# EasyEDA Pro project firefly_rp2040.eprj, board PCB2
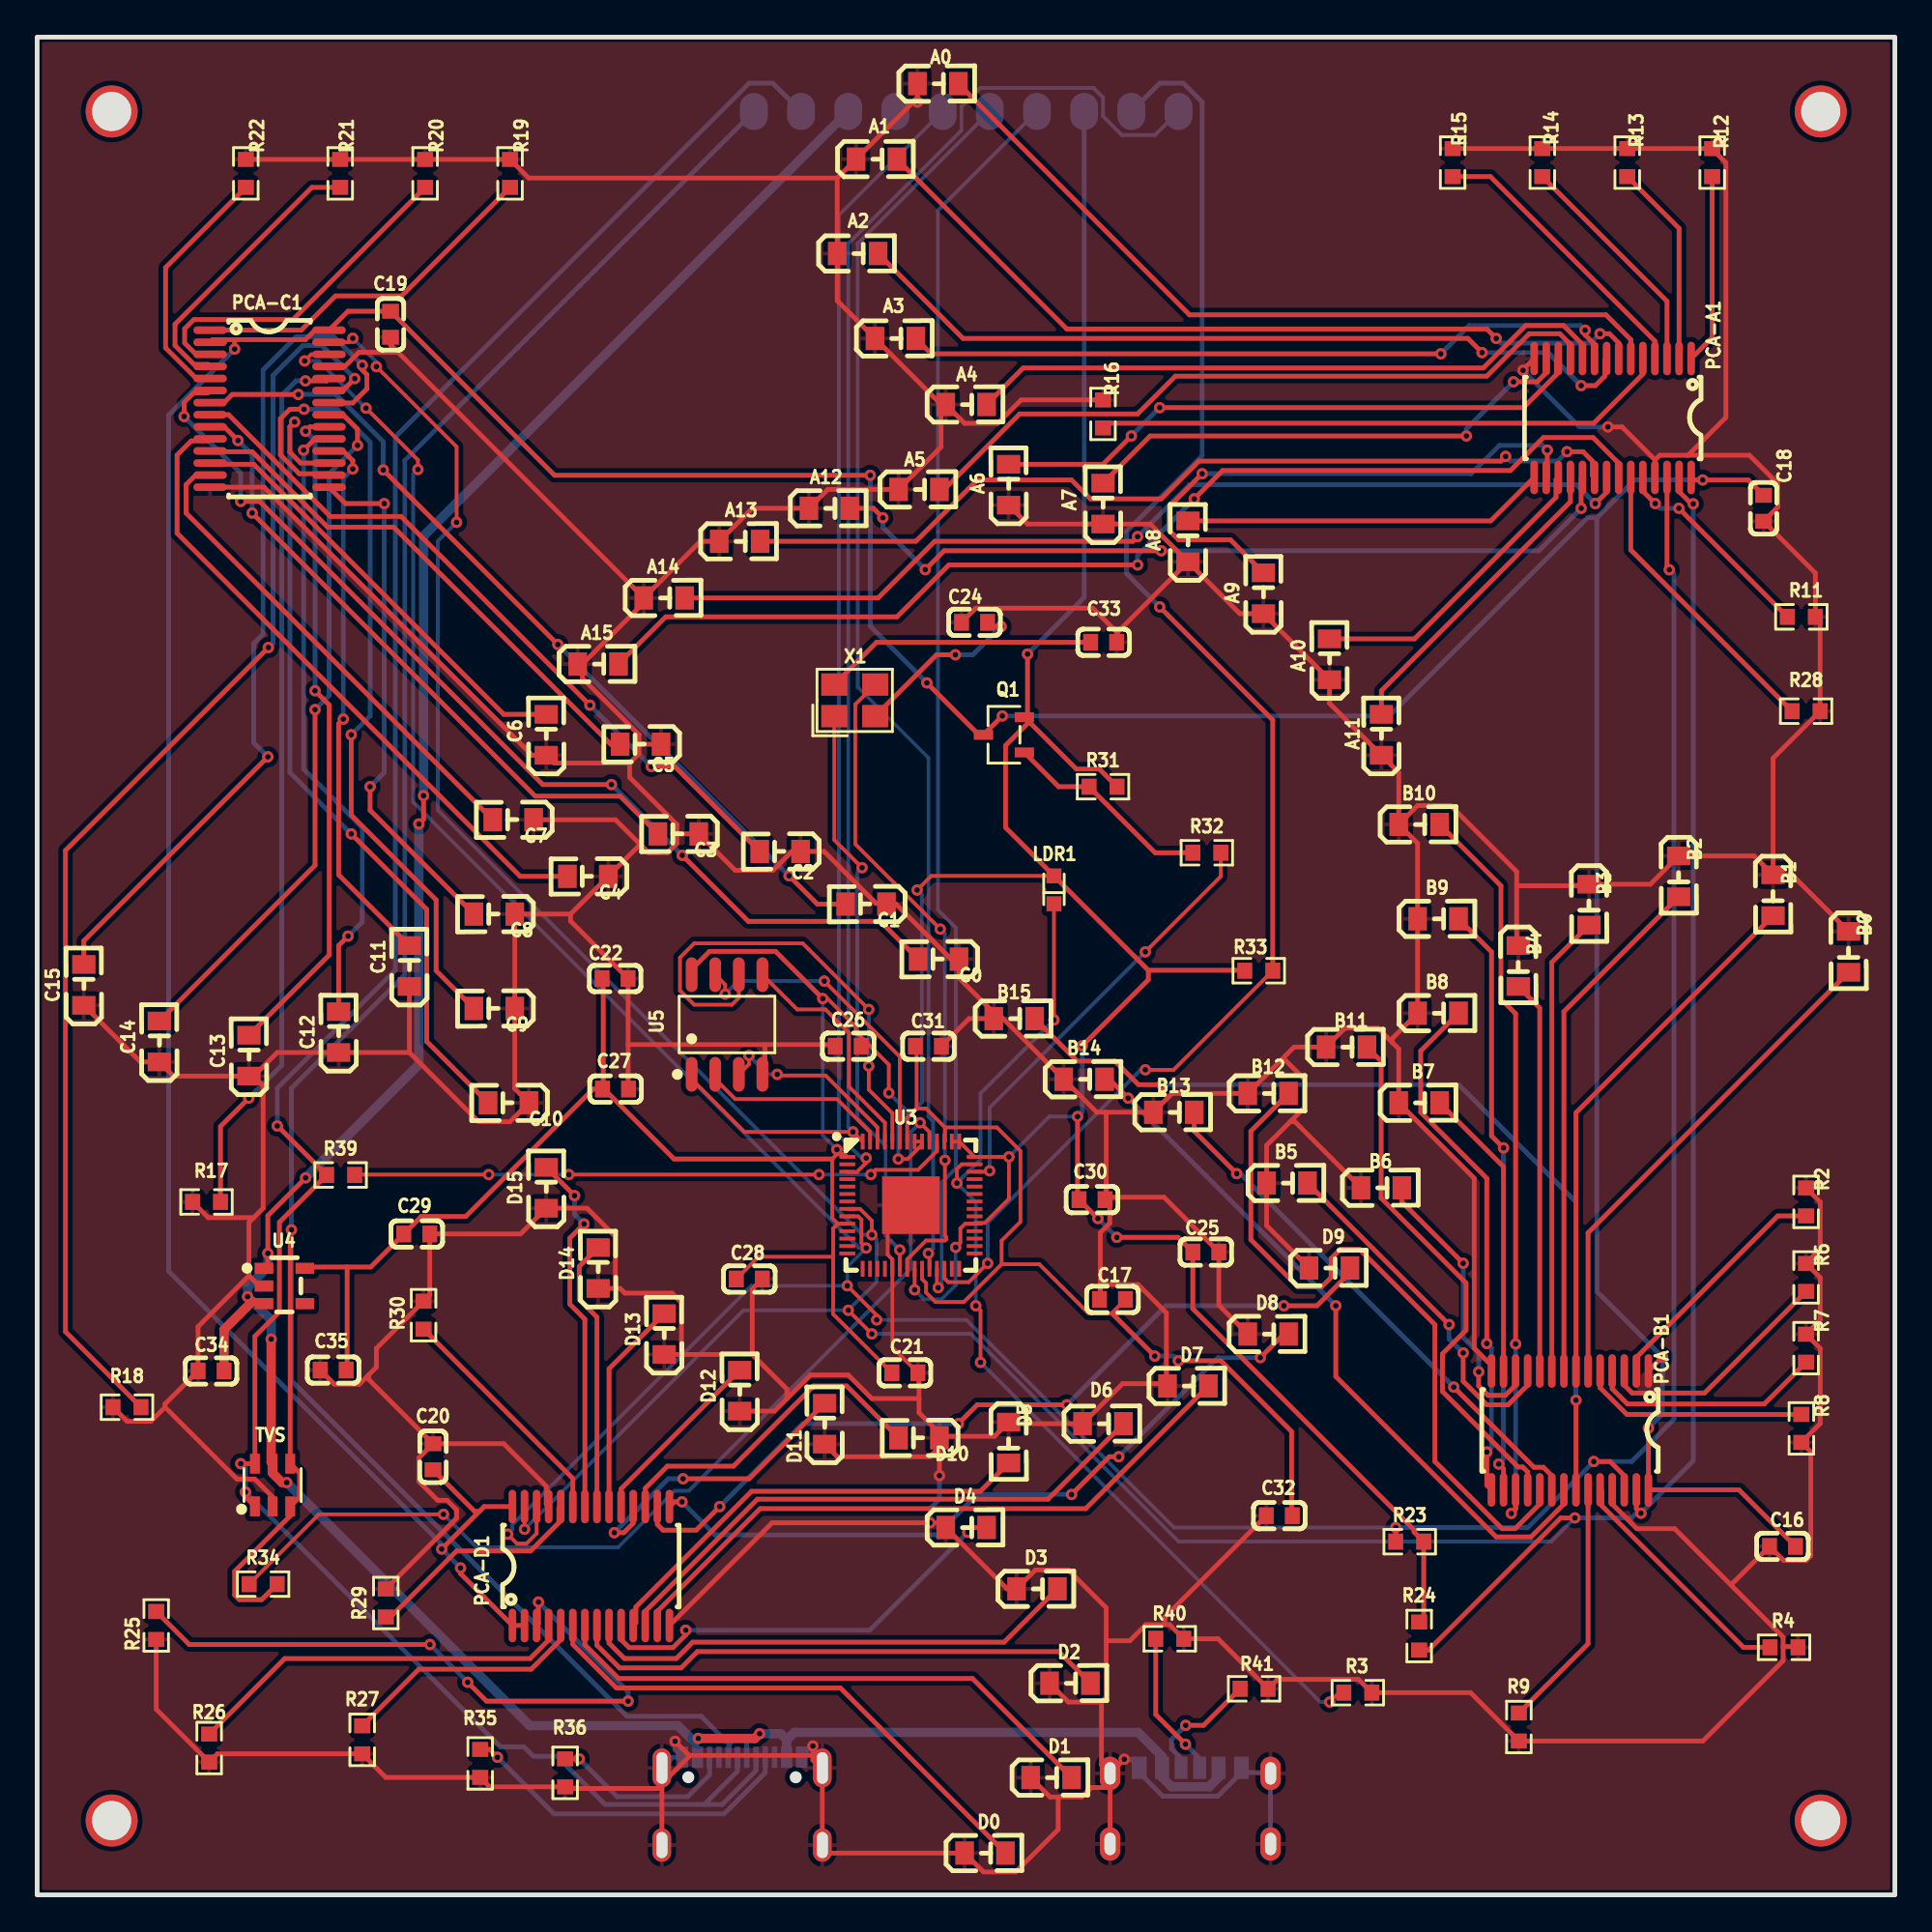
[diagram p3: board, top side]
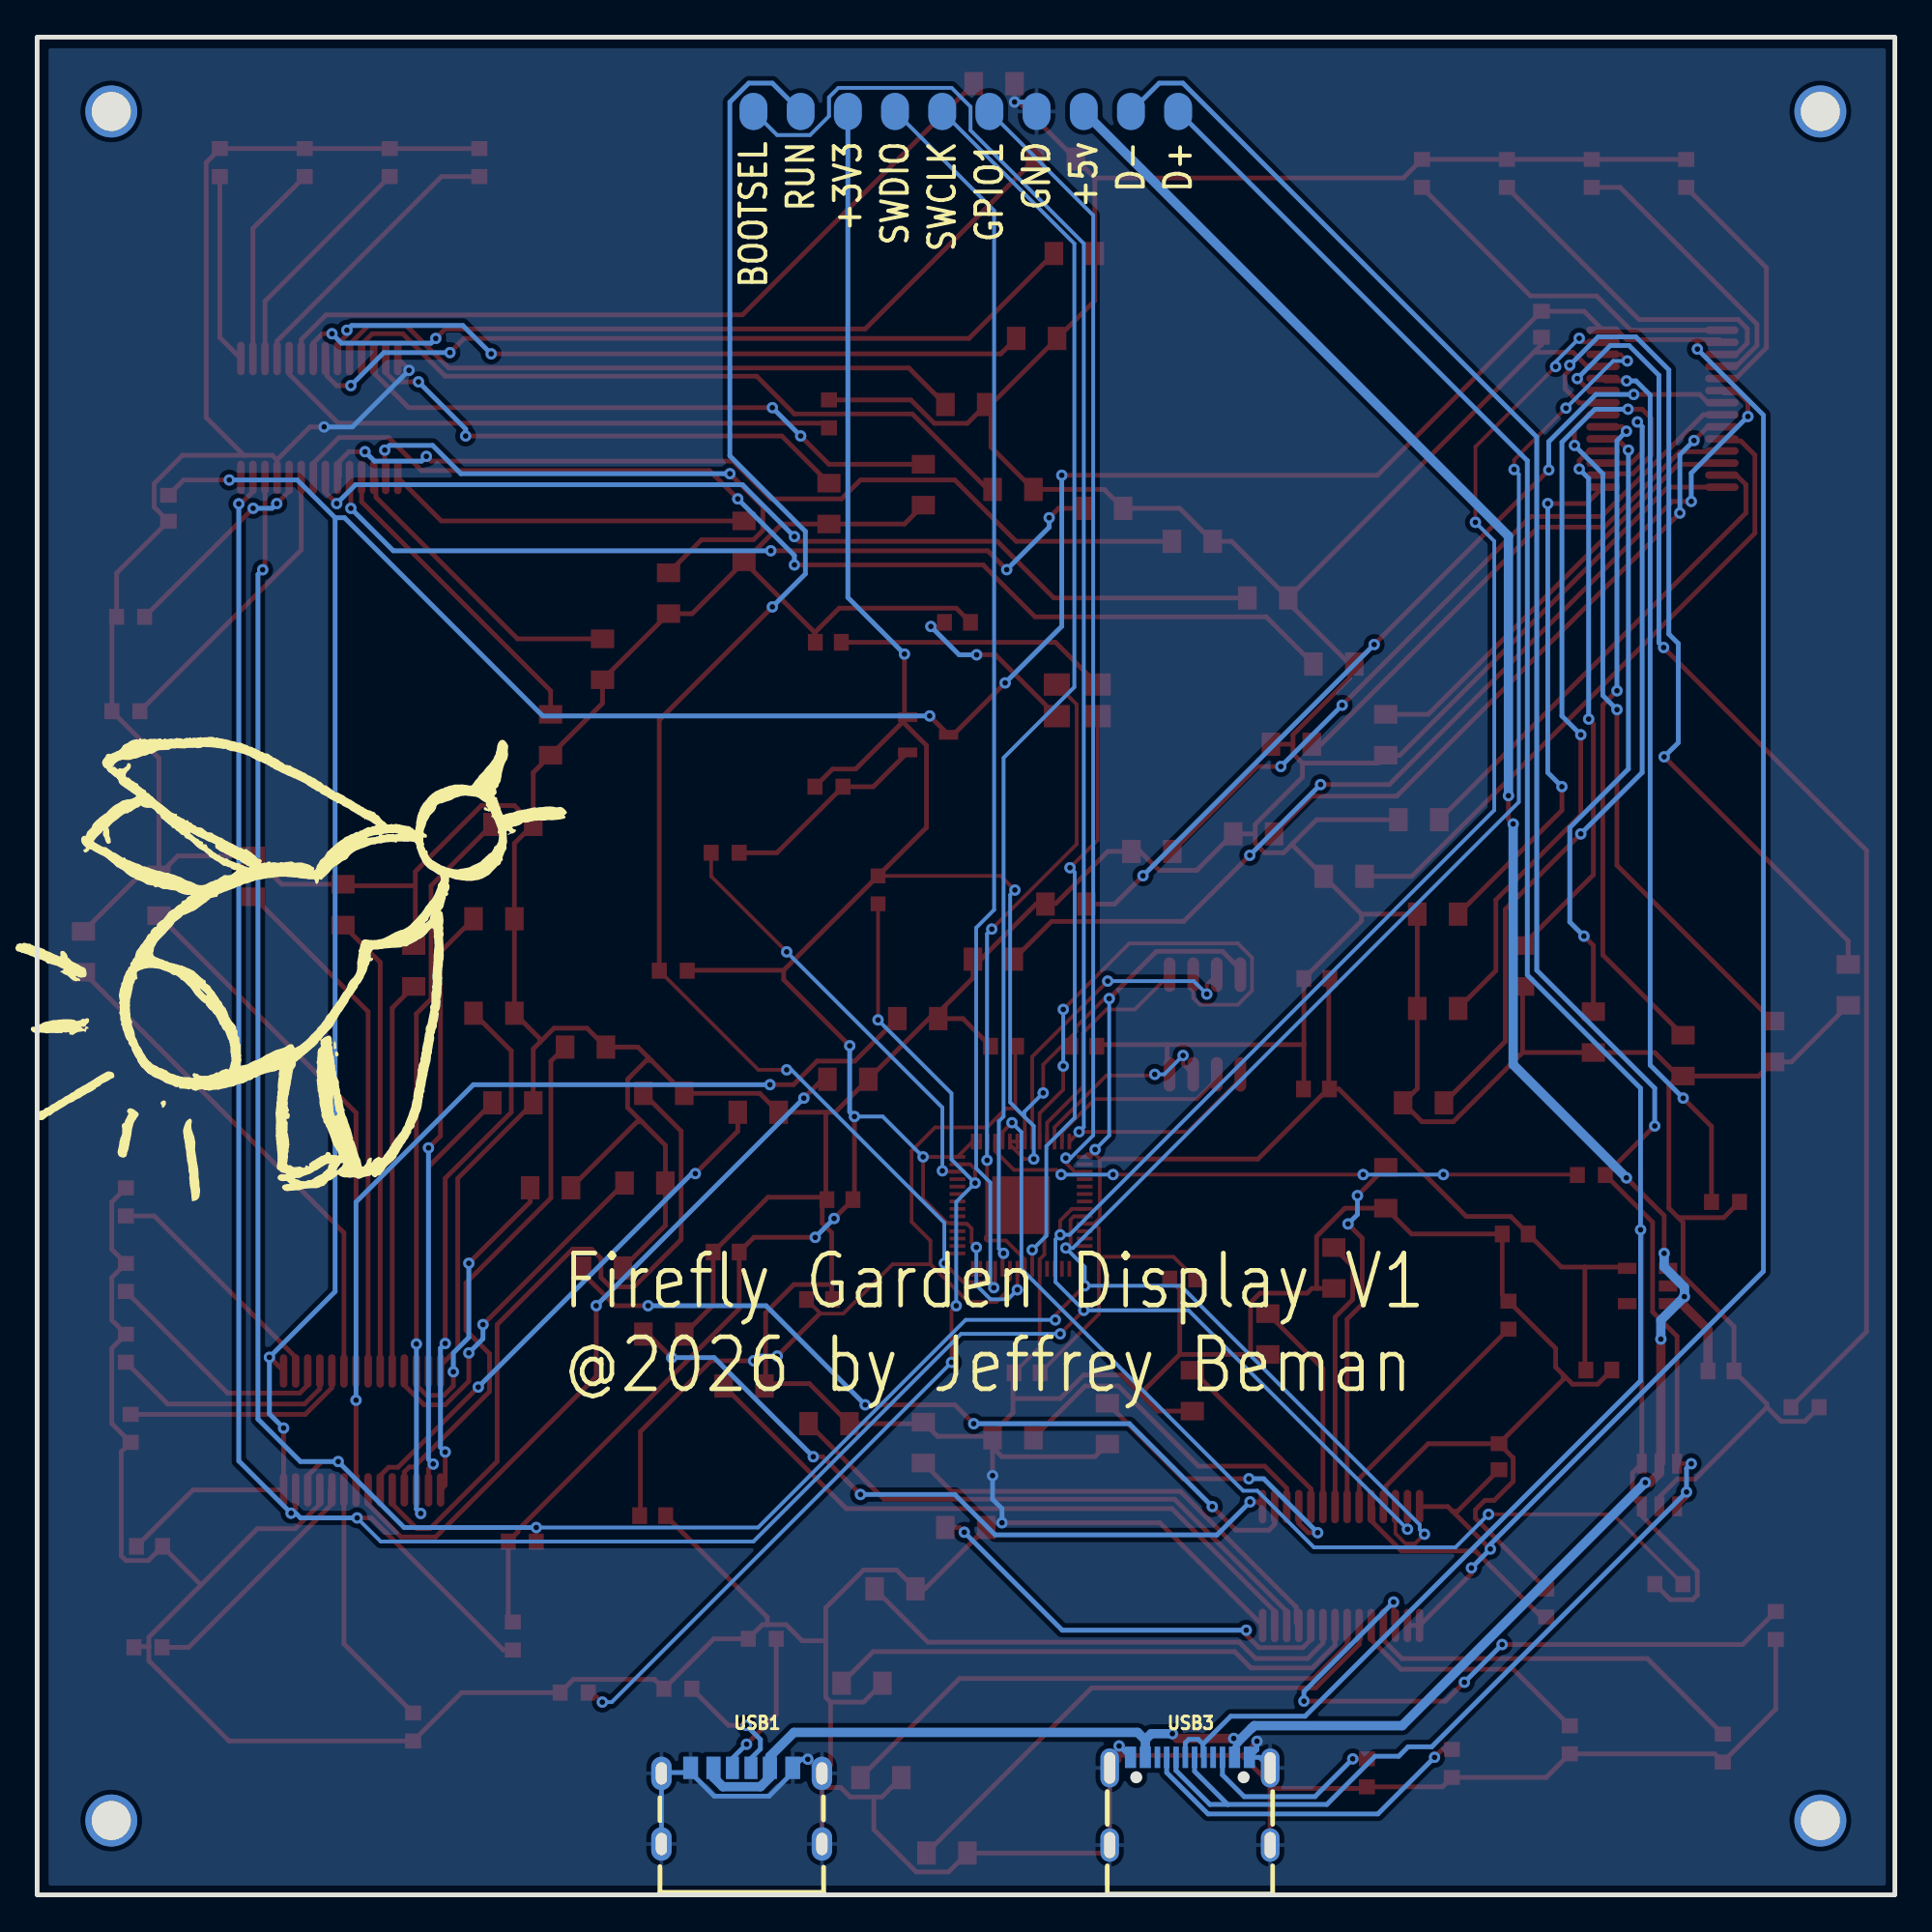
[diagram p4: board, bottom side, seen from below]

Outline 100 x 100 mm; copper layers: Top Layer, Bottom Layer. Coordinates in mm from the lower left corner of the outline.
Outline path: rectangle 0,100 100,0
Stack: Top Layer 0.035mm / Dielectric1 1.51mm FR4 er 4.5 / Bottom Layer 0.035mm

## Design rules (mm)
template: Custom Config
spacing copperThickness1oz (default): track to track 0.102, other pairs 0.152 to 0.3
track width copperThickness1oz (default): min 0.127, default 0.254, max 2.54
differential pair differentialPair (default): width min 0.127, default 0.254, max 2.54; gap min 0.152, default 0.152
via viaSize (default): diameter min 0.5, default 0.61, max 10; hole min 0.3, default 0.305, max 6.3

## Placement (name value [footprint] x y rotation side)
A0  XL-2012WWC  [LED0805-RD_WHITE]  48.49 97.5 0 top
A1  XL-2012WWC  [LED0805-RD_WHITE]  45.18 93.43 0 top
A2  XL-2012WWC  [LED0805-RD_WHITE]  44.17 88.35 0 top
A3  XL-2012WWC  [LED0805-RD_WHITE]  46.2 83.78 0 top
A4  XL-2012WWC  [LED0805-RD_WHITE]  50.01 80.23 0 top
A5  XL-2012WWC  [LED0805-RD_WHITE]  47.47 75.65 0 top
A6  XL-2012WWC  [LED0805-RD_WHITE]  52.3 75.91 90 top
A7  XL-2012WWC  [LED0805-RD_WHITE]  57.38 74.89 90 top
A8  XL-2012WWC  [LED0805-RD_WHITE]  61.95 72.86 90 top
A9  XL-2012WWC  [LED0805-RD_WHITE]  66.01 70.07 90 top
A10  XL-2012WWC  [LED0805-RD_WHITE]  69.57 66.51 90 top
A11  XL-2012WWC  [LED0805-RD_WHITE]  72.36 62.45 90 top
A12  XL-2012WWC  [LED0805-RD_WHITE]  42.64 74.64 0 top
A13  XL-2012WWC  [LED0805-RD_WHITE]  37.82 72.86 0 top
A14  XL-2012WWC  [LED0805-RD_WHITE]  33.75 69.81 0 top
A15  XL-2012WWC  [LED0805-RD_WHITE]  30.2 66.26 0 top
B0  XL-2012WWC  [LED0805-RD_WHITE]  97.51 50.76 270 top
B1  XL-2012WWC  [LED0805-RD_WHITE]  93.44 53.81 270 top
B2  XL-2012WWC  [LED0805-RD_WHITE]  88.36 54.83 270 top
B3  XL-2012WWC  [LED0805-RD_WHITE]  83.54 53.3 270 top
B4  XL-2012WWC  [LED0805-RD_WHITE]  79.73 50 270 top
B5  XL-2012WWC  [LED0805-RD_WHITE]  67.28 38.32 0 top
B6  XL-2012WWC  [LED0805-RD_WHITE]  72.36 38.06 0 top
B7  XL-2012WWC  [LED0805-RD_WHITE]  74.39 42.63 0 top
B8  XL-2012WWC  [LED0805-RD_WHITE]  75.41 47.46 0 top
B9  XL-2012WWC  [LED0805-RD_WHITE]  75.41 52.54 0 top
B10  XL-2012WWC  [LED0805-RD_WHITE]  74.39 57.62 0 top
B11  XL-2012WWC  [LED0805-RD_WHITE]  70.48 45.64 0 top
B12  XL-2012WWC  [LED0805-RD_WHITE]  66.27 43.14 0 top
B13  XL-2012WWC  [LED0805-RD_WHITE]  61.19 42.13 0 top
B14  XL-2012WWC  [LED0805-RD_WHITE]  56.36 43.9 0 top
B15  XL-2012WWC  [LED0805-RD_WHITE]  52.6 47.17 0 top
C0  XL-2012WWC  [LED0805-RD_WHITE]  48.52 50.37 180 top
C1  XL-2012WWC  [LED0805-RD_WHITE]  44.62 53.33 180 top
C2  XL-2012WWC  [LED0805-RD_WHITE]  40 56.17 180 top
C3  XL-2012WWC  [LED0805-RD_WHITE]  34.52 57.11 180 top
C4  XL-2012WWC  [LED0805-RD_WHITE]  29.64 54.83 180 top
C5  XL-2012WWC  [LED0805-RD_WHITE]  32.48 61.94 180 top
C6  XL-2012WWC  [LED0805-RD_WHITE]  27.4 62.45 90 top
C7  XL-2012WWC  [LED0805-RD_WHITE]  25.63 57.87 180 top
C8  XL-2012WWC  [LED0805-RD_WHITE]  24.61 52.79 180 top
C9  XL-2012WWC  [LED0805-RD_WHITE]  24.61 47.71 180 top
C10  XL-2012WWC  [LED0805-RD_WHITE]  25.37 42.63 180 top
C11  XL-2012WWC  [LED0805-RD_WHITE]  20.04 50 90 top
C12  XL-2012WWC  [LED0805-RD_WHITE]  16.23 46.44 90 top
C13  XL-2012WWC  [LED0805-RD_WHITE]  11.4 45.17 90 top
C14  XL-2012WWC  [LED0805-RD_WHITE]  6.58 45.94 90 top
C15  XL-2012WWC  [LED0805-RD_WHITE]  2.51 48.98 90 top
C16  100nF  [C0603]  93.95 18.76 0 top
C17  1uF  [C0603]  57.89 32.05 0 top
C18  100nF  [C0603]  92.94 74.64 90 top
C19  100nF  [C0603]  19.02 84.54 90 top
C20  100nF  [C0603]  21.31 23.58 270 top
C21  100nF  [C0603]  46.71 28.1 0 top
C22  100nF  [C0603]  31.11 49.33 0 top
C24  15pF  [C0603]  50.46 68.5 0 top
C25  100nF  [C0603]  62.91 34.6 0 top
C26  100nF  [C0603]  43.66 45.68 180 top
C27  100nF  [C0603]  31.14 43.38 0 top
C28  100nF  [C0603]  38.33 33.15 0 top
C29  100nF  [C0603]  20.44 35.58 0 top
C30  1uF  [C0603]  56.79 37.42 0 top
C31  1uF  [C0603]  47.98 45.68 0 top
C32  1uF  [C0603]  66.86 20.41 0 top
C33  15pF  [C0603]  57.41 67.42 180 top
C34  1uF  [C0603]  9.36 28.2 0 top
C35  1uF  [C0603]  15.94 28.25 0 top
D0  XL-2012WWC  [LED0805-RD_WHITE]  51.03 2.25 0 top
D1  XL-2012WWC  [LED0805-RD_WHITE]  54.58 6.31 0 top
D2  XL-2012WWC  [LED0805-RD_WHITE]  55.6 11.39 0 top
D3  XL-2012WWC  [LED0805-RD_WHITE]  53.82 16.47 0 top
D4  XL-2012WWC  [LED0805-RD_WHITE]  50.01 19.77 0 top
D5  XL-2012WWC  [LED0805-RD_WHITE]  52.3 24.35 270 top
D6  XL-2012WWC  [LED0805-RD_WHITE]  57.38 25.36 0 top
D7  XL-2012WWC  [LED0805-RD_WHITE]  61.95 27.39 0 top
D8  XL-2012WWC  [LED0805-RD_WHITE]  66.27 30.19 0 top
D9  XL-2012WWC  [LED0805-RD_WHITE]  69.57 33.74 0 top
D10  XL-2012WWC  [LED0805-RD_WHITE]  47.47 24.6 180 top
D11  XL-2012WWC  [LED0805-RD_WHITE]  42.39 25.36 90 top
D12  XL-2012WWC  [LED0805-RD_WHITE]  37.82 27.14 90 top
D13  XL-2012WWC  [LED0805-RD_WHITE]  33.75 30.19 90 top
D14  XL-2012WWC  [LED0805-RD_WHITE]  30.2 33.74 90 top
D15  XL-2012WWC  [LED0805-RD_WHITE]  27.4 38.06 90 top
LDR1  ALS-PT19-315C/L177/TR8  [SENSORS-SMD_ALS-PT19]  54.73 54.1 270 top
NOREF  -  [Pad_e138]  48.74 96 0 top
NOREF#2  -  [Pad_e68]  43.66 96 0 top
NOREF#3  -  [Pad_e48094]  53.82 96 90 top
NOREF#4  -  [Pad_e142921]  46.2 96 180 top
NOREF#5  -  [Pad_e120]  96.01 96 0 top
NOREF#6  -  [Pad_e48092]  61.44 96 90 top
NOREF#7  -  [Pad_e48095]  58.9 96 90 top
NOREF#8  -  [Pad_e113]  41.12 96 0 top
NOREF#9  -  [Pad_e109]  38.58 96 0 top
NOREF#10  -  [Pad_e119]  56.36 96 0 top
NOREF#11  -  [Pad_e123]  96.01 4 0 top
NOREF#12  -  [Pad_e118]  4.01 96 0 top
NOREF#13  -  [Pad_e122]  4.01 4 0 top
NOREF#14  -  [Pad_e48093]  51.28 96 90 top
PCA-A1  PCA9685PW,118  [TSSOP-28_L9.7-W4.4-P0.65-LS6.4-TL]  84.81 79.5 270 top
PCA-B1  PCA9685PW,118  [TSSOP-28_L9.7-W4.4-P0.65-LS6.4-TL]  82.51 25 270 top
PCA-C1  PCA9685PW,118  [TSSOP-28_L9.7-W4.4-P0.65-LS6.4-TL]  12.51 80 0 top
PCA-D1  PCA9685PW,118  [TSSOP-28_L9.7-W4.4-P0.65-LS6.4-TL]  29.81 17.7 90 top
Q1  FDN340P  [SOT-23-3_L3.0-W1.7-P0.95-LS2.9-BR]  52.04 62.45 0 top
R2  10kΩ  [R0603]  95.22 37.3 270 top
R3  47kΩ  [R0603]  71.09 10.88 0 top
R4  10kΩ  [R0603]  94.04 13.32 0 top
R6  10kΩ  [R0603]  95.22 33.24 270 top
R7  10kΩ  [R0603]  95.22 29.43 270 top
R8  10kΩ  [R0603]  94.97 25.11 90 top
R9  10kΩ  [R0603]  79.76 9.03 270 top
R11  10kΩ  [R0603]  94.97 68.8 0 top
R12  10kΩ  [R0603]  90.17 93.25 270 top
R13  10kΩ  [R0603]  85.6 93.25 270 top
R14  10kΩ  [R0603]  81.02 93.25 270 top
R15  10kΩ  [R0603]  76.2 93.25 270 top
R16  10kΩ  [R0603]  57.38 79.72 270 top
R17  10kΩ  [R0603]  9.12 37.3 180 top
R18  10kΩ  [R0603]  4.84 26.25 180 top
R19  10kΩ  [R0603]  25.46 92.67 270 top
R20  10kΩ  [R0603]  20.88 92.67 270 top
R21  10kΩ  [R0603]  16.31 92.67 270 top
R22  10kΩ  [R0603]  11.23 92.67 270 top
R23  4.7kΩ  [R0603]  73.89 19.01 180 top
R24  4.7kΩ  [R0603]  74.39 13.93 270 top
R25  10kΩ  [R0603]  6.41 14.5 90 top
R26  10kΩ  [R0603]  9.26 7.9 90 top
R27  10kΩ  [R0603]  17.5 8.34 90 top
R28  10kΩ  [R0603]  95.22 63.72 0 top
R29  10kΩ  [R0603]  18.77 15.71 90 top
R30  10kΩ  [R0603]  20.8 31.2 90 top
R31  100kΩ  [R0603]  57.38 59.65 0 top
R32  220Ω  [R0603]  62.96 56.1 0 top
R33  10kΩ  [R0603]  65.76 49.75 0 top
R34  27.4Ω  [R0603]  12.16 16.73 0 top
R35  5.1kΩ  [R0603]  23.85 7.07 270 top
R36  5.1kΩ  [R0603]  28.42 6.57 270 top
R39  27.4Ω  [R0603]  16.34 38.75 180 top
R40  5.1kΩ  [R0603]  60.97 13.78 0 top
R41  5.1kΩ  [R0603]  65.51 11.09 0 top
TVS  USBLC6-2SC6  [SOT-23-6_L2.9-W1.6-P0.95-LS2.8-BL]  12.67 22.06 0 top
U3  RP2040  [LQFN-56_L7.0-W7.0-P0.4-EP]  47.04 37.12 0 top
U4  AP2112K-3.3TRG1  [SOT-23-5_L2.9-W1.6-P0.95-LS2.8-BR]  13.31 32.78 180 top
U5  W25Q16JVSNIQ  [SOP-8_L4.9-W3.9-P1.27-LS6.0-BL]  37.14 46.85 0 top
USB1  USB-312-B-SU  [USB-C-SMD_10P-P1.00-L6.8-W8.9]  62.08 4.79 180 bottom
USB3  TYPE-C16PIN  [USB-C-SMD_TYPE-C16PIN]  37.95 5.04 180 bottom
X1  12MHz  [CRYSTAL-SMD_4P-L3.2-W2.5-BL]  44.01 64.3 0 top

## Footprints (pads in the part's own frame, mm; a bottom-side part is the same pattern mirrored in y, then rotated)
C0603
  rect 0.8x0.9 smd: 1(-0.7,0) 2(0.7,0)
CRYSTAL-SMD_4P-L3.2-W2.5-BL
  rect 1.4x1.2 smd: 1(-1.1,-0.85) 2(1.1,-0.85) 3(1.1,0.85) 4(-1.1,0.85)
LED0805-RD_WHITE
  rect 1x1.25 smd: 1(-1.1,0) 2(1.1,0)
LQFN-56_L7.0-W7.0-P0.4-EP
  rect 0.85x0.2 smd: 1(-3.425,2.6) 2(-3.425,2.2) 3(-3.425,1.8) 4(-3.425,1.4) 5(-3.425,1) 6(-3.425,0.6) 7(-3.425,0.2) 8(-3.425,-0.2) 9(-3.425,-0.6) 10(-3.425,-1) 11(-3.425,-1.4) 12(-3.425,-1.8) 13(-3.425,-2.2) 14(-3.425,-2.6) 29(3.425,-2.6) 30(3.425,-2.2) 31(3.425,-1.8) 32(3.425,-1.4) 33(3.425,-1) 34(3.425,-0.6) 35(3.425,-0.2) 36(3.425,0.2) 37(3.425,0.6) 38(3.425,1) 39(3.425,1.4) 40(3.425,1.8) 41(3.425,2.2) 42(3.425,2.6)
  rect 0.2x0.85 smd: 15(-2.6,-3.425) 16(-2.2,-3.425) 17(-1.8,-3.425) 18(-1.4,-3.425) 19(-1,-3.425) 20(-0.6,-3.425) 21(-0.2,-3.425) 22(0.2,-3.425) 23(0.6,-3.425) 24(1,-3.425) 25(1.4,-3.425) 26(1.8,-3.425) 27(2.2,-3.425) 28(2.6,-3.425) 43(2.6,3.425) 44(2.2,3.425) 45(1.8,3.425) 46(1.4,3.425) 47(1,3.425) 48(0.6,3.425) 49(0.2,3.425) 50(-0.2,3.425) 51(-0.6,3.425) 52(-1,3.425) 53(-1.4,3.425) 54(-1.8,3.425) 55(-2.2,3.425) 56(-2.6,3.425)
  rect 3.1x3.1 smd: 57(0,0)
Pad_e68
  oval 1.5x2 smd far side: 1(0,0)
Pad_e109
  oval 1.5x2 smd far side: 8(0,0)
Pad_e113
  oval 1.5x2 smd far side: 9(0,0)
Pad_e118
  round 2.8 hole 2.1: 1(0,0)
Pad_e119
  oval 1.5x2 smd far side: 2(0,0)
Pad_e120
  round 2.8 hole 2.1: 2(0,0)
Pad_e122
  round 2.8 hole 2.1: 3(0,0)
Pad_e123
  round 2.8 hole 2.1: 4(0,0)
Pad_e138
  oval 1.5x2 smd far side: 1(0,0)
Pad_e48092
  oval 2x1.5 smd far side: 4(0,0)
Pad_e48093
  oval 2x1.5 smd far side: 7(0,0)
Pad_e48094
  oval 2x1.5 smd far side: 6(0,0)
Pad_e48095
  oval 2x1.5 smd far side: 5(0,0)
Pad_e142921
  oval 1.5x2 smd far side: 3(0,0)
R0603
  rect 0.806x0.864 smd: 1(-0.753,0) 2(0.753,0)
SENSORS-SMD_ALS-PT19
  rect 0.8x0.8 smd: 1(-0.75,0) 2(0.75,0)
SOP-8_L4.9-W3.9-P1.27-LS6.0-BL
  oval 0.63x1.865 smd: 1(-1.905,-2.683) 2(-0.635,-2.683) 3(0.635,-2.683) 4(1.905,-2.683) 5(1.905,2.683) 6(0.635,2.683) 7(-0.635,2.683) 8(-1.905,2.683)
SOT-23-3_L3.0-W1.7-P0.95-LS2.9-BR
  rect 1.038x0.532 smd: 1(1.101,-0.95) 2(1.101,0.95) 3(-1.101,0)
SOT-23-5_L2.9-W1.6-P0.95-LS2.8-BR
  rect 1x0.6 smd: 1(1.1,-0.95) 2(1.1,0) 3(1.1,0.95) 4(-1.1,0.95) 5(-1.1,-0.95)
SOT-23-6_L2.9-W1.6-P0.95-LS2.8-BL
  rect 0.532x1.072 smd: 1(-0.95,-1.149) 2(0,-1.149) 3(0.95,-1.149) 4(0.95,1.149) 5(0,1.149) 6(-0.95,1.149)
TSSOP-28_L9.7-W4.4-P0.65-LS6.4-TL
  oval 1.804x0.406 smd: 1(-3.2,4.225) 2(-3.2,3.575) 3(-3.2,2.925) 4(-3.2,2.275) 5(-3.2,1.625) 6(-3.2,0.975) 7(-3.2,0.325) 8(-3.2,-0.325) 9(-3.2,-0.975) 10(-3.2,-1.625) 11(-3.2,-2.275) 12(-3.2,-2.925) 13(-3.2,-3.575) 14(-3.2,-4.225) 15(3.2,-4.225) 16(3.2,-3.575) 17(3.2,-2.925) 18(3.2,-2.275) 19(3.2,-1.625) 20(3.2,-0.975) 21(3.2,-0.325) 22(3.2,0.325) 23(3.2,0.975) 24(3.2,1.625) 25(3.2,2.275) 26(3.2,2.925) 27(3.2,3.575) 28(3.2,4.225)
USB-C-SMD_10P-P1.00-L6.8-W8.9
  oval 1.1x1.8 hole 0.6x1.2: 0(-4.32,-2.05) 0(-4.32,1.75) 0(4.32,-2.05) 0(4.32,1.75)
  rect 0.8x1.2 smd: 1(-2.749,2.05) 6(2.749,2.05)
  rect 0.76x1.2 smd: 2(-1.52,2.05) 5(1.52,2.05)
  rect 0.7x1.2 smd: 3(-0.5,2.05) 4(0.5,2.05)
USB-C-SMD_TYPE-C16PIN
  oval 1x2.1 hole 0.6x1.7: 1(-4.32,1.788) 2(4.32,1.788)
  oval 1x1.8 hole 0.6x1.4: 3(-4.32,-2.362) 4(4.32,-2.362)
  rect 0.6x1.15 smd: A1B12(-3.2,2.362) A4B9(-2.4,2.362) B1A12(3.2,2.362) B4A9(2.4,2.362)
  rect 0.3x1.15 smd: A5(-1.25,2.362) A6(-0.25,2.362) A7(0.25,2.362) A8(1.25,2.362) B5(1.75,2.362) B6(0.75,2.362) B7(-0.75,2.362) B8(-1.75,2.362)

## Nets
As in the schematic, except:
+3V3: C21.1 C22.1 C25.1 C26.1 C27.1 C28.1 C29.1 C30.1 C35.2 LDR1.1 NOREF#10.2 Q1.2 R23.1 R24.1 R31.2 R33.1 U3.1 U3.10 U3.22 U3.33 U3.42 U3.43 U3.44 U3.48 U3.49 U4.5 U5.8
+5V_USB: C34.2 NOREF#2.1 TVS.5 U4.1 U4.3 USB1.2 USB1.5 USB3.A4B9 USB3.B4A9
GND: A0.1 A1.1 A2.1 A3.1 A4.1 A5.1 A6.1 A7.1 A8.1 A9.1 A10.1 A11.1 A12.1 A13.1 A14.1 A15.1 B0.1 B1.1 B2.1 B3.1 B4.1 B5.1 B6.1 B7.1 B8.1 B9.1 B10.1 B11.1 B12.1 B13.1 B14.1 B15.1 C0.1 C1.1 C2.1 C3.1 C4.1 C5.1 C6.1 C7.1 C8.1 C9.1 C10.1 C11.1 C12.1 C13.1 C14.1 C15.1 C16.1 C17.1 C18.1 C19.1 C20.1 C21.2 C22.2 C24.1 C25.2 C26.2 C27.2 C28.2 C29.2 C30.2 C31.2 C32.1 C33.1 C34.1 C35.1 D0.1 D1.1 D2.1 D3.1 D4.1 D5.1 D6.1 D7.1 D8.1 D9.1 D10.1 D11.1 D12.1 D13.1 D14.1 D15.1 NOREF#4.3 PCA-A1.14 PCA-A1.25 PCA-B1.14 PCA-B1.25 PCA-C1.14 PCA-C1.25 PCA-D1.14 PCA-D1.25 R2.1 R3.2 R4.2 R6.1 R7.1 R8.1 R9.2 R11.2 R12.1 R13.1 R14.1 R15.1 R16.1 R17.2 R18.2 R19.1 R20.1 R21.1 R22.1 R25.1 R26.1 R27.1 R28.2 R29.2 R30.2 R35.2 R36.2 R40.2 R41.2 TVS.2 U3.19 U3.57 U4.2 U5.4 USB1.0 USB1.1 USB1.6 USB3.1 USB3.2 USB3.3 USB3.4 USB3.A1B12 USB3.B1A12
DN: NOREF#8.9 R39.2 TVS.1 TVS.6 USB3.A7 USB3.B7
DP: NOREF#9.8 R34.2 TVS.3 TVS.4 USB3.A6 USB3.B6
GPIO1: NOREF.1 U3.3
QSPI_SS: NOREF#6.4 U3.56 U5.1
RUN: NOREF#7.5 R33.2 U3.26
SWCLK: NOREF#14.7 U3.24
SWD: NOREF#3.6 U3.25

Pads without a net: NOREF#5 2; NOREF#11 4; NOREF#12 1; NOREF#13 3; U3 2 4 5 6 7 11 12 13 14 15 16 17 18 27 28 29 30 31 32 34 35 36 37 38 39; U4 4; USB3 A8 B8

## Via types
v1: diameter 0.61, hole 0.305, Top Layer to Bottom Layer, 191 vias

## Routing (per net, layer and track width the routed paths; a pad name or vN(x,y) marks a point on that pad's centre or on a via; arc(x,y) is an arc through that point)
1V1: length 50.6
  Top Layer w0.2: 48.87,41.31 47.85,42.33 47.34,42.33 ; 48.87,41.31 51.66,41.31 52.93,40.04 52.93,36.23 51.92,35.22 51.92,33.95 ; 48.87,41.31 48.87,40.58 48.83,40.55 ; 51.92,33.95 53.95,33.95 56.61,31.29 57.88,31.29 57.88,31.34 C17.2 ; 51.92,33.95 49.88,31.91 48.36,31.91 47.85,32.42 47.85,32.93 47.64,33.15 U3.23 ; C31.1 47.34,45.62 47.34,42.33 ; 47.34,42.33 46.83,41.82 46.83,40.55
  Top Layer w0.254: 57.88,31.29 v1(60.16,29) ; 67.57,20.41 67.53,20.45 67.53,24.94 63.72,28.75 v1(61.43,28.75)
  Bottom Layer w0.254: v1(60.16,29) 61.18,29 v1(61.43,28.75)
3V3_SW: length 256.8
  Top Layer w0.254: C20.2 23.55,20.65 23.81,20.65 ; v1(86.73,25.13) PCA-B1.28 91.61,21.8 C16.2 ; v1(87.5,28.94) 87.47,28.94 PCA-B1.1 ; 10.63,83.72 v1(10.63,83.21) ; 10.63,83.72 9.45,83.72 PCA-C1.2 ; 10.63,83.72 14.44,83.72 14.95,84.22 PCA-C1.28 16.73,85.24 C19.2 27.85,76.42 v1(44.84,76.42) ; v1(47.89,65.24) 50.69,62.45 Q1.3 v1(51.96,63.46) ; v1(21.78,18.61) 23.81,20.65 ; 23.81,20.65 24.06,20.9 PCA-D1.28 ; PCA-A1.28 89.17,76.16 v1(89.66,76.16) 92.11,76.16 C18.2 ; v1(22.79,17.6) 22.79,17.29 PCA-D1.1 26.23,14.5
  Bottom Layer w0.254: v1(89.66,76.16) 85.99,76.16 83.96,74.13 ; v1(51.96,63.46) 72.78,63.46 83.45,74.13 83.96,74.13 ; v1(47.89,65.24) 44.84,68.29 v1(44.84,76.42) ; v1(22.79,17.6) v1(21.78,18.61) 21.78,18.87 7.07,33.57 7.07,79.65 v1(10.63,83.21) ; 83.96,74.13 83.96,32.47 v1(87.5,28.94) 87.5,25.89 v1(86.73,25.13)
+3V3: length 246.8
  Top Layer w0.2: 42.85,34.35 42.85,35.87 43.1,36.12 ; 42.85,34.35 42.85,31.26 C21.1 ; 42.85,34.35 38.83,34.35 C28.1 ; v1(47.37,54.09) 48.13,54.85 LDR1.1 ; v1(47.23,32.57) U3.22 ; v1(46.35,39.61) 46.86,39.61 47.64,40.38 U3.48 U3.49 ; U3.44 U3.43 U3.42 v1(52.31,39.72) 52.31,37.47 51.01,36.17 50.5,36.17 U3.33 49.95,36.12 49.7,35.87 49.7,35.11 v1(49.44,34.86) ; v1(42.29,48.25) 42.54,48.25 44.07,46.72 44.07,46.47 44.58,45.96 ; v1(45.85,43.17) 45.85,44.69 44.58,45.96 ; 44.58,45.96 C26.1 ; 43.1,36.12 U3.10 ; 43.1,36.12 42.8,36.43 42.8,39.61 43.05,39.86 43.3,39.86 ; 43.3,39.86 v1(43.05,40.12) ; 43.3,39.86 43.47,39.86 U3.1
  Top Layer w0.254: R24.1 74.64,14.93 R23.1 74.12,19.53 74.12,19.64 62.21,31.55 C25.1 61.42,35.39 v1(58.12,35.39) ; 53.4,63.14 Q1.2 53.31,63.56 v1(53.31,66.79) ; 53.4,63.14 55.94,60.6 57.18,60.6 R31.2 ; 53.4,63.14 52.13,61.87 52.13,57.46 LDR1.1 59.82,49.77 ; C35.2 16.69,28.3 16.69,33.8 ; 42.8,39.61 34.28,39.61 30.47,43.42 ; 16.69,33.8 14.48,33.8 14.41,33.72 ; 16.69,33.8 17.96,33.8 C29.1 20.68,36.52 23.07,36.52 29.93,43.38 C27.1 30.47,43.42 ; 59.82,49.77 64.98,49.77 R33.1 ; 59.82,49.77 59.82,49.26 v1(56.26,45.71) ; v1(42.29,48.25) 39.75,50.79 36.19,50.79 35.23,49.82 U5.8 ; C22.1 30.47,49.26 30.47,43.42 ; v1(56.01,41.9) 56.01,37.5 C30.1 v1(57.1,36.41)
  Bottom Layer w0.2: v1(45.85,43.17) 46.86,42.15 46.86,41.9 ; v1(47.23,32.57) 47.74,32.06 48.68,32.06 49.44,32.82 v1(49.44,34.86) ; v1(52.31,39.72) 54.48,41.9 v1(56.01,41.9) ; 46.86,41.9 46.35,41.39 v1(46.35,39.61) ; 46.86,41.9 47.62,42.66 47.62,53.83 v1(47.37,54.09) ; v1(43.05,40.12) 42.29,40.88 v1(42.29,48.25)
  Bottom Layer w0.254: v1(57.1,36.41) v1(58.12,35.39) ; v1(56.26,45.71) 56.26,42.15 v1(56.01,41.9) ; NOREF#10.2 56.36,69.84 v1(53.31,66.79)
+5V_USB: length 155.4
  Top Layer w0.254: 12.21,31.82 12.09,31.95 11.58,31.95 v1(11.33,32.2) ; v1(14.45,38.6) 12.42,36.56 v1(12.42,34.53) 12.42,33.93 12.21,33.72 ; v1(20.8,59.17) 20.8,57.9 v1(20.55,57.65)
  Top Layer w0.5: v1(12.6,29.91) 12.6,23.28 TVS.5 12.67,22.7 13.18,22.19 v1(13.43,22.19) ; v1(38.89,8.67) 38.64,8.42 v1(35.59,8.42) ; 11.58,31.95 10.06,30.43 C34.2
  Bottom Layer w0.254: v1(35.59,8.42) 35.33,8.17 35.55,7.96 USB3.B4A9 ; 40.35,7.98 USB3.A4B9
  Bottom Layer w0.5: 40.35,8.33 40.35,8.36 40.03,8.67 v1(38.89,8.67) ; 40.35,8.33 40.35,7.98 ; 40.35,8.33 40.76,8.74 59.26,8.74 60.55,7.45 USB1.5 60.55,6.33 61.06,5.82 63.09,5.82 63.6,6.33 USB1.2 ; 35.38,8.21 35.38,8.22 34.63,8.97 34.62,8.97 34.49,9.11 26.52,9.11 v1(13.43,22.19) ; v1(20.8,59.17) 20.8,73.14 NOREF#2.1 ; v1(12.6,29.91) 12.6,30.93 v1(11.33,32.2) 11.33,32.71 12.42,33.8 v1(12.42,34.53) ; v1(20.55,57.65) 20.55,44.69 v1(14.45,38.6)
GND: length 910.8
  Top Layer w0.2: C21.2 46.04,29.47 U3.19 46.04,34.21 45.78,34.46 45.78,35.87 U3.57
  Top Layer w0.254: 20.04,45.34 23.76,41.62 25.46,41.62 C10.1 25.71,43.4 C9.1 C8.1 28.71,52.79 ; 20.04,45.34 C11.1 ; 20.04,45.34 C12.1 12.93,45.34 11.66,44.07 ; 57.55,13.68 58.82,13.68 59.68,14.55 60.7,14.55 ; 57.55,13.68 57.55,10.63 57.29,10.38 ; 57.55,13.68 57.55,15.46 55.51,17.49 53.74,17.49 D3.1 52.21,16.47 D4.1 48.66,20.03 v1(48.06,20.03) 39.56,20.03 PCA-D1.14 ; C33.1 58.14,67.45 58.14,67.95 ; PCA-B1.14 78.29,28.5 77.36,29.43 77.36,38.57 B7.1 73.29,45.54 72.94,45.89 ; 41.76,7.51 41.76,7.25 42.27,6.74 ; 41.76,7.51 35.15,7.51 ; 41.76,7.51 v1(41.76,8.01) ; 60.79,27.52 60.79,31.33 59.26,32.85 57.23,32.85 ; 60.79,27.52 D7.1 ; 60.79,27.52 58.43,27.52 D6.1 52.38,25.36 D5.1 51.53,24.68 48.74,24.68 ; 43.07,92.42 26.46,92.42 R19.1 R20.1 R21.1 R22.1 ; 43.07,92.42 A1.1 47.16,96.51 v1(47.39,96.51) A0.1 ; 43.07,92.42 A2.1 43.07,85.81 A3.1 48.66,80.23 ; 87.09,77.24 87.09,76.31 PCA-A1.25 ; 87.09,77.24 87.35,77.49 88.87,77.49 ; 87.09,77.24 85.32,79.02 v1(84.55,79.02) ; 29.35,66.26 29.35,65.49 32.4,62.45 32.4,61.94 ; 29.35,66.26 A15.1 ; 29.35,66.26 32.65,69.56 A14.1 ; U5.4 39.18,44.3 39.18,45.77 ; R18.2 4.84,25.49 6.12,25.49 6.88,26.25 ; PCA-C1.25 16.56,82.28 17.32,83.04 19.43,83.04 ; C31.2 50.16,47.17 B15.1 51.66,47.32 ; 32.4,56.6 32.4,56.48 C4.1 28.71,52.79 ; 32.4,56.6 31.13,57.87 C7.1 ; 32.4,56.6 32.91,56.1 33.92,56.1 34.43,56.6 34.43,57.11 ; 33.63,5.73 33.63,2.68 ; 33.63,5.73 33.63,5.98 35.15,7.51 ; 33.63,5.73 28.51,5.73 R36.2 24.36,5.81 R35.2 18.77,6.32 R27.1 9.7,7.59 R26.1 6.41,10 R25.1 ; 34.68,29.09 D13.1 ; 34.68,29.09 38.49,29.09 ; 34.68,29.09 34.68,31.88 34.18,32.39 31.64,32.39 31.38,32.64 31.13,32.64 ; 31.13,32.64 D14.1 ; 31.13,32.64 31.13,35.44 29.6,36.96 D15.1 26.02,35.58 C29.2 21.14,32.29 R30.2 18.26,29.42 18.26,28.4 17.85,28 ; 31.81,45.77 39.18,45.77 ; 31.81,45.77 C22.2 28.71,52.42 28.71,52.79 ; 31.81,45.77 31.81,43.4 C27.2 ; 39.18,45.77 42.87,45.77 C26.2 ; 88.87,77.49 92.17,77.49 93.7,75.97 93.7,74.7 C18.1 95.72,71.15 R11.2 95.98,68.54 R28.2 93.44,61.18 B1.1 ; 88.87,77.49 90.9,79.53 90.9,93.24 90.14,94 ; 57.76,5.78 USB1.0 ; 57.76,5.78 56.74,5.78 56.23,5.27 54.96,5.27 ; 57.76,5.78 USB1.0 ; 57.29,10.38 55.51,10.38 D2.1 ; 57.29,10.38 57.29,7 USB1.0 ; 57.55,37.55 C30.2 57.74,37.17 57.74,36.16 57.23,35.65 57.23,32.85 ; 57.55,37.55 60.66,37.55 C25.2 63.61,31.74 D8.1 ; 57.55,37.55 57.55,42.13 ; 48.57,24.09 D10.1 48.65,24.68 48.74,24.68 ; 48.57,24.09 v1(48.57,22.57) ; 48.57,24.09 48.06,23.58 43.07,23.58 D11.1 ; 6.88,26.25 6.88,26.42 C34.1 8.66,30.59 11.4,33.33 ; 6.88,26.25 10.75,22.38 11.71,22.38 12.67,21.42 TVS.2 ; 51.66,47.32 49.62,49.35 C0.1 49.19,50.37 46.23,53.33 C1.1 45.68,53.37 45.16,53.37 42.37,56.17 C2.1 40.63,56.17 39.61,55.15 37.58,55.15 C3.1 34.43,57.11 ; 51.66,47.32 51.84,47.32 B14.1 57.04,42.13 57.55,42.13 ; 34.43,57.11 34.43,57.62 31.89,60.16 31.89,60.92 ; 35.15,7.51 35.1,7.51 v1(34.34,8.27) ; 47.47,26.72 44.93,26.72 43.66,27.99 41.63,27.99 40.36,26.72 ; 47.47,26.72 47.47,25.95 48.74,24.68 ; 47.47,26.72 47.47,28.04 C21.2 ; B1.1 92.43,55.93 B2.1 86.84,54.4 B3.1 83.45,54.32 79.64,54.32 ; B1.1 94.46,54.91 B0.1 ; 38.49,29.09 38.49,32.61 C28.2 ; 38.49,29.09 40.36,27.22 40.36,26.72 ; 17.85,28 17.35,27.49 16,27.49 C35.1 ; 17.85,28 17.85,27.74 C20.1 ; 58.14,67.95 56.83,69.26 50.52,69.26 C24.1 ; 58.14,67.95 A8.1 ; 57.55,42.13 B13.1 61.1,43.14 B12.1 66.94,44.92 ; 11.66,44.07 12.16,43.57 12.16,36.96 11.66,36.45 ; 11.66,44.07 C13.1 7.34,44.07 C14.1 5.56,44.84 C15.1 ; B10.1 74.31,56.6 B9.1 B8.1 72.94,46.09 72.94,45.89 ; B10.1 74.31,58.64 76.09,58.64 79.64,55.08 79.64,54.32 ; B10.1 73.29,60.41 A11.1 69.57,64.14 A10.1 A9.1 64.74,68.97 A8.1 ; 72.94,45.89 72.18,46.65 70.4,46.65 B11.1 67.66,45.64 66.94,44.92 ; 31.89,60.92 32.4,61.43 32.4,61.94 ; 31.89,60.92 27.83,60.92 C6.1 26.64,61.35 12.21,75.78 PCA-C1.14 ; USB1.0 v1(58.52,7.3) ; 93.98,13.36 94.75,13.36 R4.2 ; 93.98,13.36 93.98,12.6 89.67,8.28 R9.2 77.16,10.88 R3.2 71.13,11.6 66.77,11.6 R41.2 63.57,13.78 R40.2 60.96,14.55 60.7,14.55 ; 93.98,13.36 93.98,13.87 91.19,16.66 ; R14.1 R15.1 ; 60.7,14.55 60.7,14.95 C32.1 ; 11.66,36.45 9.21,36.45 R17.2 ; 11.66,36.45 11.4,36.2 11.4,33.33 ; 42.27,6.74 USB3.3 42.7,2.25 D0.1 50.94,1.23 52.67,1.23 54.96,3.52 54.96,5.27 ; 42.27,6.74 USB3.1 ; R2.1 95.98,37.29 95.98,34.75 R6.1 95.98,33.23 95.98,30.94 R7.1 95.98,29.42 95.98,25.37 R8.1 95.48,23.85 95.48,18.25 95.22,18 94.01,18 C16.1 91.19,16.7 91.19,16.66 ; D12.1 39.68,26.04 40.36,26.72 ; A8.1 59.92,73.79 A7.1 53.31,73.79 A6.1 ; R16.1 52.97,80.47 51.7,79.21 49.93,79.21 A4.1 48.66,80.23 ; 54.96,5.27 54.53,5.27 D1.1 ; C19.1 19.02,83.44 19.43,83.04 ; 67.45,41.62 66.18,40.35 B5.1 66.18,36.03 D9.1 ; 67.45,41.62 67.71,41.62 B6.1 ; 67.45,41.62 68.21,42.38 68.21,43.9 67.2,44.92 66.94,44.92 ; C17.1 57.23,32.1 57.23,32.85 ; B4.1 79.64,51.18 79.64,54.32 ; 48.66,80.23 48.66,77.94 A5.1 42.56,75.65 A12.1 38.5,74.64 A13.1 35.7,72.86 A14.1 ; A14.1 19.43,83.04 ; 11.4,33.33 11.96,32.78 U4.2 ; 91.19,16.66 88.14,19.71 86.11,19.71 84.79,21.04 PCA-B1.25 ; 90.14,94 85.57,94 ; 90.14,94 R12.1 ; 85.57,94 R13.1 ; 85.57,94 81.03,94 ; PCA-A1.14 79.98,82.1 v1(79.98,82.07) ; 32.4,61.94 C5.1 ; C20.1 25.12,24.28 27.4,22 27.4,21.03 PCA-D1.25 ; C20.1 20.55,23.52 20.55,22.25 21.56,21.24 22.07,21.24 22.58,20.73 22.58,20.27 R29.2
  Bottom Layer w0.254: USB1.0 USB1.0 66.35,6.58 64.82,6.58 ; v1(47.39,96.51) 46.71,96.51 NOREF#4.3 ; v1(48.06,20.03) 48.06,20.79 48.57,21.3 v1(48.57,22.57) ; 64.82,6.58 USB1.1 ; 64.82,6.58 63.55,5.31 60.6,5.31 59.33,6.58 USB1.6 58.86,7.3 v1(58.52,7.3) ; v1(79.98,82.07) 83.03,79.02 v1(84.55,79.02) ; USB3.2 34.2,7.4 USB3.B1A12 34.34,7.81 v1(34.34,8.27) ; 41.75,8.01 USB3.A1B12
DN: length 133.5
  Top Layer w0.254: v1(11.21,21.69) 11.21,21.42 TVS.1 ; v1(12.93,41.39) 12.94,41.39 R39.2 13.04,36.21 13.04,31.38 11.72,30.06 TVS.6 v1(10.96,23.21)
  Bottom Layer w0.254: v1(12.93,41.39) 12.93,43.42 19.28,49.77 19.28,78.47 38.33,97.52 39.6,97.52 NOREF#8.9 ; 35.91,4.86 36.87,4.86 38.7,6.69 USB3.B7 ; 35.91,4.86 30.57,4.86 27.98,7.46 26.71,7.46 26.2,7.97 24.93,7.97 v1(11.21,21.69) 11.21,22.96 v1(10.96,23.21) ; 35.91,4.86 37.7,6.65 USB3.A7
DP: length 137
  Top Layer w0.254: v1(13.69,35.8) 13.62,35.74 TVS.4 14.13,22.7 14.13,21.42 TVS.3 13.62,20.4 10.63,17.41 10.63,16.14 10.89,15.89 12.08,15.89 R34.2
  Bottom Layer w0.254: 37.25,8.12 37.25,7.46 USB3.B6 ; 37.25,8.12 37.5,8.37 38.01,8.37 38.2,8.18 USB3.A6 ; 37.25,8.12 35.75,9.61 31.75,9.61 13.69,27.67 v1(13.69,35.8) 13.69,43.42 19.78,49.52 19.78,77.2 NOREF#9.8
GPIO1: length 60.9
  Top Layer w0.2: v1(44.63,39.66) 44.63,39.41 44.12,38.9 43.64,38.9 U3.3
  Bottom Layer w0.2: v1(44.63,39.66) 44.37,39.66 43.15,40.88 43.15,90.41 NOREF.1
LDR_ADC: length 56.5
  Top Layer w0.2: R3.1 70.08,10.88 v1(69.58,10.38) ; v1(50.53,31.71) 50.78,31.46 v1(50.78,28.66) ; U3.41 49.76,39.33 49.51,39.07 v1(49.51,38.32) ; v1(54.73,47.1) LDR1.2
  Bottom Layer w0.2: v1(69.58,10.38) 69.07,10.38 v1(50.78,28.66) ; v1(54.73,47.1) 50.78,43.14 50.78,39.59 v1(49.51,38.32) 50.53,37.3 v1(50.53,31.71)
PWR_SW_CTRL: length 23.1
  Top Layer w0.2: v1(51.27,38.97) 51.22,38.92 U3.40 ; v1(59.65,50.76) 63.72,54.83 R32.2
  Bottom Layer w0.2: v1(51.27,38.97) 51.27,42.38 v1(59.65,50.76)
QSPI_SS: length 82.9
  Top Layer w0.2: U5.1 35.23,43.91 38.07,41.07 v1(43.91,41.07) U3.56
  Bottom Layer w0.2: NOREF#6.4 60.17,94.73 58.39,94.73 57.38,95.75 57.38,96.76 56.87,97.27 50.77,97.27 49.76,96.25 49.76,94.98 43.66,88.89 43.66,41.33 v1(43.91,41.07)
RUN: length 83.1
  Top Layer w0.2: R33.2 61.18,44.41 v1(59.65,44.41) ; v1(51.17,34) 50.15,32.98 49.04,32.98 48.83,33.19 48.83,33.7
  Top Layer w0.254: v1(60.42,69.33) 66.51,63.24 R33.2
  Bottom Layer w0.2: v1(59.65,44.41) 59.4,44.41 51.17,36.18 v1(51.17,34)
  Bottom Layer w0.254: NOREF#7.5 60.42,97.52 61.69,97.52 62.71,96.51 62.71,77.46 58.65,73.39 58.65,71.11 v1(60.42,69.33)
SCL: length 201.7
  Top Layer w0.2: v1(14.4,82.57) 14.75,82.92 PCA-C1.26 ; v1(43.61,32.79) 45.19,31.2 v1(45.19,30.95) ; PCA-D1.26 26.89,19.45 26.34,18.91 25.83,18.91 v1(25.32,19.41) ; v1(20.5,76.73) 20.5,77.24 v1(17.7,80.03) ; v1(44.63,34.82) 44.37,35.07 44.37,36.34 44.19,36.53 U3.9
  Top Layer w0.254: 87.73,76.3 87.73,71.45 v1(87.86,71.33) ; PCA-B1.26 85.44,22.56 84.67,23.32 v1(83.79,23.32) ; R23.2 v1(73.13,19.77)
  Bottom Layer w0.2: v1(17.7,80.03) 15.16,82.57 v1(14.4,82.57) ; v1(25.32,19.41) 25.58,19.67 25.58,19.92 38.44,32.79 v1(43.61,32.79) 43.61,33.8 v1(44.63,34.82) 44.25,34.82 20.24,58.82 20.24,76.47 v1(20.5,76.73) ; v1(45.19,30.95) 50.02,30.95 61.19,19.77 v1(73.13,19.77)
  Bottom Layer w0.254: v1(87.86,71.33) 88.11,71.08 88.11,25.61 85.83,23.32 v1(83.79,23.32) 80.24,19.77 v1(73.13,19.77)
SDA: length 211.5
  Top Layer w0.2: U3.8 44.3,36.92 44.93,36.29 v1(44.93,35.53) ; v1(26.23,19.68) 26.23,20.9 ; v1(16.99,83.79) 16.77,83.58 PCA-C1.27 ; v1(44.93,30.2) v1(43.66,31.47) ; v1(18.26,82.27) 22.58,77.95 v1(22.58,73.88)
  Top Layer w0.254: v1(82.78,20.29) 82.01,20.29 74.9,13.18 R24.2 ; v1(86.33,20.54) 86.08,20.79 PCA-B1.27 ; PCA-A1.27 88.39,75.54 89.04,74.88 v1(89.15,74.88)
  Bottom Layer w0.2: v1(16.99,83.79) 18.26,82.52 v1(18.26,82.27) ; v1(82.78,20.29) 81.51,19.02 61.44,19.02 50.26,30.2 v1(44.93,30.2) ; v1(26.23,19.68) 38.02,31.47 v1(43.66,31.47) 45.18,32.99 45.18,35.28 v1(44.93,35.53) 44.42,35.53 21.56,58.39 21.56,72.87 v1(22.58,73.88)
  Bottom Layer w0.254: v1(82.78,20.29) 85.82,20.29 86.08,20.54 v1(86.33,20.54) 89.15,23.36 v1(89.15,74.88)
SWCLK: length 67.1
  Top Layer w0.2: U3.24 48.04,34.47 v1(47.98,34.53)
  Bottom Layer w0.2: NOREF#14.7 44.17,88.89 44.17,65.01 47.98,61.2 47.98,41.9 48.23,41.64 48.23,34.79 v1(47.98,34.53)
SWD: length 67.4
  Top Layer w0.2: v1(48.51,32.68) 48.44,32.75 U3.25
  Bottom Layer w0.2: v1(48.51,32.68) 48.69,32.87 48.69,38.34 49.45,39.1 49.45,52.06 48.49,53.02 48.49,90.67 NOREF#3.6
XIN: length 31.4
  Top Layer w0.2: X1.1 42.91,56.78 v1(44.4,55.29) ; U3.20 v1(46.44,34.72)
  Bottom Layer w0.2: v1(46.44,34.72) 45.67,35.48 45.67,40.3 44.15,41.83 44.15,55.04 v1(44.4,55.29)
XOUT: length 35.4
  Top Layer w0.2: 46.83,33.7 46.83,34.21 47.85,35.22 48.87,35.22 48.93,35.29 48.93,35.41 48.87,35.48 v1(48.87,39.54) ; X1.3 44.04,64.08 44.04,56.56 v1(48.61,51.99)
  Bottom Layer w0.2: v1(48.61,51.99) 48.87,51.73 v1(48.87,39.54)
$1N878: length 11.3
  Top Layer w0.254: Q1.1 54.99,59.65 R31.1 60.18,56.1 R32.1
$1N2988: length 53.4
  Top Layer w0.2: v1(21.87,20.48) 15.17,20.48 R34.1 ; v1(47.53,41.57) 48.04,41.06 U3.47
  Bottom Layer w0.2: v1(47.53,41.57) 47.02,41.06 47.02,33.69 35.08,21.75 34.32,21.75 31.27,18.71 23.65,18.71 v1(21.87,20.48)
$1N3420: length 18.5
  Top Layer w0.254: R35.1 24.36,7.83 v1(24.78,7.4)
  Bottom Layer w0.254: v1(24.78,7.4) 27.83,4.36 36.97,4.36 39.2,6.58 USB3.A5
$1N3520: length 10
  Top Layer w0.254: R36.1 v1(29.18,7.32)
  Bottom Layer w0.254: USB3.B5 36.2,6.46 35.02,5.29 31.21,5.29 v1(29.18,7.32)
$1N3802: length 10.3
  Top Layer w0.2: 44.83,40.55 44.83,41.06 43.06,42.84 37.58,42.84 36.56,43.85 36.56,44.11 U5.2
$1N3811: length 10.5
  Top Layer w0.2: U3.54 45.23,41.31 42.44,44.11 39.9,44.11 v1(39.84,44.17) ; v1(38.32,45.18) 38.32,44.71 U5.3
  Bottom Layer w0.2: v1(39.84,44.17) 39.33,44.17 v1(38.32,45.18)
$1N3818: length 17.2
  Top Layer w0.2: U3.51 46.44,45.12 v1(42.37,49.19) ; U5.7 37.04,49 v1(37.04,48.49)
  Bottom Layer w0.2: v1(42.37,49.19) 37.74,49.19 v1(37.04,48.49)
$1N3834: length 26.2
  Top Layer w0.2: U5.6 37.77,48.29 37.4,47.92 35.37,47.92 34.61,48.68 34.61,50.46 35.37,51.22 41.21,51.22 v1(44.77,47.66) ; U3.52 46.04,42.07 44.77,43.34 v1(44.77,44.61)
  Bottom Layer w0.2: v1(44.77,44.61) v1(44.77,47.66)
$1N3846: length 12.6
  Top Layer w0.2: U3.53 45.64,41.57 43.7,43.5 43.7,46.39 42.43,47.66 40.91,47.66 U5.5
$1N4199: length 32.4
  Top Layer w0.2: v1(44.88,38.77) 45.13,39.03 47.42,39.03 48.44,40.04 U3.46 ; R39.1 17.11,38.77 v1(24.31,38.77) ; v1(42.08,38.77) v1(28.62,38.77)
  Bottom Layer w0.2: v1(28.62,38.77) v1(24.31,38.77) ; v1(44.88,38.77) v1(42.08,38.77)
$1N6880: length 9.6
  Top Layer w0.254: C24.2 51.38,68.28 v1(51.89,68.28) ; v1(49.43,66.75) 48.41,66.75 X1.2
  Bottom Layer w0.254: v1(49.43,66.75) 50.37,66.75 v1(51.89,68.28)
$1N6912: length 14.7
  Top Layer w0.254: X1.4 45.19,67.42 C33.2
$1N17853: length 7.9
  Top Layer w0.254: v1(61.81,8.11) 60.21,9.71 R40.1
  Bottom Layer w0.254: v1(61.81,8.11) 62.58,7.35 USB1.3
$1N17864: length 6.6
  Top Layer w0.254: R41.1 62.79,9.12 v1(61.83,9.12)
  Bottom Layer w0.254: v1(61.83,9.12) 61.07,8.36 61.07,7.85 61.57,7.35 USB1.4
$2N3361: length 44.2
  Top Layer w0.254: v1(84.13,84.04) 84.64,84.04 85.15,83.53 85.15,82.71 PCA-A1.7 ; A1.2 55.43,84.29 78.03,84.29 v1(78.54,83.78)
  Bottom Layer w0.254: v1(84.13,84.04) 83.62,83.53 78.8,83.53 v1(78.54,83.78)
$2N3362: length 43.3
  Top Layer w0.254: PCA-A1.8 84.38,82.6 84.38,81.75 83.88,81.24 v1(83.11,81.24) ; v1(77.78,83.02) 77.02,83.78 49.84,83.78 A2.2
  Bottom Layer w0.254: v1(77.78,83.02) 81.34,83.02 v1(83.11,81.24)
$2N3363: length 38.8
  Top Layer w0.254: 83.83,82.7 83.83,83.46 83.33,83.97 v1(83.33,84.22) ; v1(75.56,82.95) 48.13,82.95 A3.2
  Bottom Layer w0.254: v1(75.56,82.95) 77.08,84.48 83.07,84.48 v1(83.33,84.22)
$2N3364: length 38.4
  Top Layer w0.254: A5.2 48.82,75.65 52.89,79.72 59.24,79.72 61.27,81.75 78.03,81.75 80.32,84.04 81.96,84.04 82.47,83.53 82.47,82.77 PCA-A1.11
$2N3365: length 32.4
  Top Layer w0.254: A6.2 57.38,77.01 v1(58.9,78.53) ; v1(60.42,80.06) 80,80.06 81.78,81.83 81.78,82.6 PCA-A1.12
  Bottom Layer w0.254: v1(58.9,78.53) v1(60.42,80.06)
$2N3366: length 27.3
  Top Layer w0.254: 81.23,82.7 81.25,82.68 81.25,81.95 80.74,81.45 v1(79.47,81.45) ; A7.2 59.92,78.53 v1(76.93,78.53)
  Bottom Layer w0.254: v1(79.47,81.45) 76.93,78.91 v1(76.93,78.53)
$2N3367: length 35
  Top Layer w0.254: A4.2 53.08,82.19 77.85,82.19 80.13,84.48 82.16,84.48 83.19,83.46 PCA-A1.10
$2N3369: length 42.9
  Top Layer w0.254: A0.2 62.03,85.05 84.45,85.05 85.79,83.72 PCA-A1.6
$2N3370: length 27.3
  Top Layer w0.254: PCA-B1.6 83.48,35.64 B0.2
$2N3372: length 21.2
  Top Layer w0.254: PCA-B1.10 80.89,47.74 B4.2
$2N3373: length 15.9
  Top Layer w0.254: PCA-B1.13 78.94,39.19 B7.2
$2N3374: length 15.6
  Top Layer w0.254: B6.2 73.46,37.3 v1(76.76,34) ; PCA-B1.12 79.54,28.16 79.54,27.39 79.03,26.89 78.11,26.89 77.6,27.39 v1(77.6,28.16)
  Bottom Layer w0.254: v1(77.6,28.16) 77.6,29.17 76.76,30 v1(76.76,34)
$2N3375: length 19.3
  Top Layer w0.254: B5.2 v1(76,30.7) ; PCA-B1.11 80.19,28.16 80.19,27.39 79.17,26.38 78.03,26.38 76.76,27.65 v1(76.76,29.17)
  Bottom Layer w0.254: v1(76,30.7) 76,29.93 v1(76.76,29.17)
$2N3376: length 24.8
  Top Layer w0.254: B3.2 81.54,50.2 PCA-B1.9
$2N3377: length 28.1
  Top Layer w0.254: B2.2 82.19,47.55 PCA-B1.8
$2N3378: length 28.9
  Top Layer w0.254: B1.2 82.83,42.1 PCA-B1.7
$2N3379: length 46.7
  Top Layer w0.254: PCA-C1.7 10.06,80.33 10.5,80.77 v1(14.06,80.77) ; v1(40.47,54.86) 42,53.33 C1.2 ; v1(28.03,67.3) v1(18.63,76.7)
  Bottom Layer w0.254: v1(18.63,76.7) 18.63,78.23 16.09,80.77 v1(14.06,80.77) ; v1(40.47,54.86) v1(28.03,67.3)
$2N3380: length 39.3
  Top Layer w0.254: C2.2 34.32,60.74 v1(33.05,60.74) ; PCA-C1.8 10.31,79.67 15.78,74.2 19.59,74.2 v1(29.75,64.04)
  Bottom Layer w0.254: v1(33.05,60.74) v1(29.75,64.04)
$2N3381: length 35
  Top Layer w0.254: v1(10.81,78.29) 10.07,79.03 PCA-C1.9 ; v1(11.57,74.38) 26.81,59.14 31.38,59.14 C3.2
  Bottom Layer w0.254: v1(11.57,74.38) 11.57,77.53 v1(10.81,78.29)
$2N3382: length 28.6
  Top Layer w0.254: PCA-C1.11 9.35,77.69 11.57,77.69 15.64,73.62 19.19,73.62 30.88,61.94 C5.2
$2N3383: length 23.7
  Top Layer w0.254: PCA-C1.12 9.38,77.01 11.66,77.01 25.12,63.55 C6.2
$2N3384: length 26.4
  Top Layer w0.254: PCA-C1.13 8.53,76.42 8.02,75.91 8.02,74.38 C7.2
$2N3385: length 35
  Top Layer w0.254: C4.2 26,54.83 7.53,73.3 7.53,77.5 8.29,78.26 9.2,78.26 PCA-C1.10
$2N3387: length 54.9
  Top Layer w0.254: v1(30.91,59.77) 27.22,59.77 11.98,75.01 v1(10.96,75.01) ; PCA-C1.6 9.19,80.85 8.42,80.85 7.91,80.34 v1(7.91,79.58) ; C0.2 45.39,52.4 38.28,52.4 v1(34.72,55.96)
  Bottom Layer w0.254: v1(10.96,75.01) 10.96,76.53 v1(7.91,79.58) ; v1(34.72,55.96) v1(30.91,59.77)
$2N3401: length 13.6
  Top Layer w0.254: PCA-B1.23 83.48,13.51 R9.1
$2N3402: length 13
  Top Layer w0.254: PCA-B1.2 86.08,28.93 93.7,36.55 R2.2
$2N3403: length 13
  Top Layer w0.254: R6.2 89.75,27.01 85.86,27.01 85.44,27.44 PCA-B1.3
$2N3404: length 12.7
  Top Layer w0.254: PCA-B1.4 84.79,27.24 85.61,26.42 92.97,26.42 R7.2
$2N3405: length 12.3
  Top Layer w0.254: PCA-B1.5 84.14,27.3 85.57,25.86 R8.2
$2N3406: length 13.1
  Top Layer w0.254: PCA-B1.24 84.23,21.71 84.23,20.94 91.85,13.32 R4.1
$2N3407: length 16.2
  Top Layer w0.254: R28.1 85.79,72.4 PCA-A1.23
$2N3408: length 11.3
  Top Layer w0.254: PCA-A1.24 86.44,75.56 v1(87.1,74.89) ; R11.1 v1(88.37,74.64)
  Bottom Layer w0.254: v1(88.37,74.64) 87.36,74.64 v1(87.1,74.89)
$2N3409: length 10.3
  Top Layer w0.254: R12.2 90.17,83.83 PCA-A1.1
$2N3410: length 10.9
  Top Layer w0.254: R13.2 88.39,89.71 PCA-A1.2
$2N3411: length 12.6
  Top Layer w0.254: 87.73,82.7 87.73,85.78 R14.2
$2N3412: length 15.5
  Top Layer w0.254: R15.2 78.23,92.49 87.08,83.64 PCA-A1.4
$2N3413: length 31.1
  Top Layer w0.254: PCA-A1.5 86.44,81.86 83.79,79.22 57.63,79.22 R16.2
$2N3414: length 47.7
  Top Layer w0.254: v1(11.39,42.89) 9.87,41.36 R17.1 ; v1(14.44,81.5) 15.58,81.5 PCA-C1.24
  Bottom Layer w0.254: v1(11.39,42.89) 13.17,44.67 13.17,80.73 13.93,81.5 v1(14.44,81.5)
$2N3416: length 69.3
  Top Layer w0.254: v1(17.09,81.62) 16.45,80.97 PCA-C1.23 ; v1(12.45,67.14) 1.52,56.22 1.52,30.31 R18.1
  Bottom Layer w0.254: v1(12.45,67.14) 12.7,67.4 12.7,81.8 14.3,83.4 15.32,83.4 v1(17.09,81.62)
$2N3417: length 19.3
  Top Layer w0.254: PCA-C1.1 14.21,84.22 16.06,86.07 19.61,86.07 R19.2
$2N3418: length 18.5
  Top Layer w0.254: PCA-C1.3 8.55,82.92 7.94,83.53 7.94,84.31 8.44,84.8 13.77,84.8 R20.2
$2N3419: length 15.4
  Top Layer w0.254: PCA-C1.4 9.2,82.39 8.44,82.39 7.42,83.4 7.42,84.55 14.79,91.91 R21.2
$2N3420: length 13.5
  Top Layer w0.254: PCA-C1.5 8.57,81.62 6.91,83.28 6.91,87.59 R22.2
$2N3422: length 13.4
  Top Layer w0.254: PCA-D1.5 28.19,13.74 26.59,12.15 20.55,12.15 R27.2
$2N3423: length 21.2
  Top Layer w0.254: R26.2 13.32,12.72 26.53,12.72 27.54,13.72 PCA-D1.4
$2N3426: length 12.9
  Top Layer w0.254: R30.1 28.83,22.42 28.83,20.9
$2N3427: length 12.3
  Top Layer w0.254: PCA-D1.24 28.08,20.8 28.08,20.04 26.56,18.51 22.58,18.51 19.02,14.96 R29.1
$2N3432: length 29
  Top Layer w0.254: 28.83,14.5 28.83,13.48 31.18,11.14 43.24,11.14 D0.2
$2N3433: length 23.4
  Top Layer w0.254: v1(34.91,14.25) 34.91,13.99 34.23,13.31 31.87,13.31 31.44,13.74 PCA-D1.10 ; D4.2 50.35,19.77 v1(50.09,19.52)
  Bottom Layer w0.254: v1(34.91,14.25) 44.82,14.25 v1(50.09,19.52)
$2N3434: length 35.4
  Top Layer w0.254: PCA-D1.13 33.39,15.26 38.92,20.79 56.44,20.79 D7.2
$2N3435: length 30.7
  Top Layer w0.254: D6.2 54.41,21.3 38.77,21.3 32.73,15.26 32.73,14.5
$2N3436: length 24.3
  Top Layer w0.254: PCA-D1.11 32.23,14.65 32.23,15.5 38.45,21.72 50.77,21.72 D5.2
$2N3437: length 27
  Top Layer w0.254: D3.2 52.05,13.6 35.29,13.6 34.41,12.72 31.61,12.72 30.79,13.55 PCA-D1.9
$2N3438: length 29.2
  Top Layer w0.254: PCA-D1.8 30.14,13.44 31.36,12.21 34.66,12.21 35.54,13.09 55,13.09 D2.2
$2N3439: length 30.2
  Top Layer w0.254: PCA-D1.7 29.48,13.46 31.3,11.65 50.35,11.65 D1.2
$2N3440: length 36
  Top Layer w0.254: v1(26.98,15.76) 26.98,14.6 PCA-D1.3 ; v1(23.17,11.44) 24.19,10.43 v1(31.81,10.43) ; v1(21.14,13.48) 8.19,13.48 R25.2
  Bottom Layer w0.254: v1(21.14,13.48) v1(23.17,11.44) ; v1(26.98,15.76) 31.81,10.94 v1(31.81,10.43)
$2N3441: length 60.5
  Top Layer w0.254: PCA-A1.22 85.14,77.06 83.75,78.45 81.08,78.45 79.3,76.67 63.81,76.67 v1(62.29,75.15) ; A15.2 33.84,68.8 46.28,68.8 49.08,71.59 v1(59.24,71.59)
  Bottom Layer w0.254: v1(59.24,71.59) 59.24,72.1 v1(62.29,75.15)
$2N3442: length 53.6
  Top Layer w0.254: v1(59.24,73.11) 58.98,72.86 48.32,72.86 45.27,69.81 A14.2 ; PCA-A1.21 84.48,75.5 v1(83.88,74.89)
  Bottom Layer w0.254: v1(83.88,74.89) 82.86,75.91 62.03,75.91 v1(59.24,73.11)
$2N3443: length 49
  Top Layer w0.254: v1(79.05,77.43) 78.8,77.18 62.54,77.18 60.51,75.15 56.7,75.15 55.68,76.16 50.6,76.16 47.3,72.86 A13.2 ; v1(82.35,77.69) 83.21,77.69 83.72,77.18 83.72,76.42 83.83,76.3
  Bottom Layer w0.254: v1(79.05,77.43) 79.3,77.18 81.84,77.18 v1(82.35,77.69)
$2N3444: length 44.1
  Top Layer w0.254: A12.2 45.01,74.64 v1(45.52,74.13) ; PCA-A1.19 83.11,76.23 v1(83.11,74.64) ; v1(60.51,72.35) 48.82,72.35 v1(47.81,71.34)
  Bottom Layer w0.254: v1(60.51,72.35) 80.83,72.35 v1(83.11,74.64) ; v1(47.81,71.34) 45.52,73.62 v1(45.52,74.13)
$2N3445: length 17
  Top Layer w0.254: A11.2 72.36,64.82 82.54,74.99 PCA-A1.18
$2N3446: length 16.5
  Top Layer w0.254: A10.2 74.14,67.61 81.76,75.23 81.76,76.17 PCA-A1.17
$2N3447: length 30.6
  Top Layer w0.254: v1(62.71,76.5) 60.93,74.72 60.93,73.45 61.44,72.94 64.23,72.94 A9.2 ; 81.23,76.3 81.29,76.35 v1(81.29,77.77)
  Bottom Layer w0.254: v1(62.71,76.5) 77.19,76.5 78.71,78.02 81.04,78.02 v1(81.29,77.77)
$2N3448: length 19.6
  Top Layer w0.254: A8.2 78.25,73.96 PCA-A1.15
$2N3449: length 48.7
  Top Layer w0.254: B15.2 55.98,44.88 58.01,44.88 59.28,43.61 v1(60.55,43.61) ; v1(82.83,26.63) PCA-B1.22
  Bottom Layer w0.254: v1(82.83,26.63) 82.83,37.29 76.52,43.61 v1(60.55,43.61)
$2N3450: length 38.7
  Top Layer w0.254: v1(58.73,42.89) 57.71,43.9 B14.2 ; v1(69.91,31.71) 69.91,27.9 78.54,19.27 80.41,19.27 82.19,21.04 PCA-B1.21
  Bottom Layer w0.254: v1(58.73,42.89) v1(69.91,31.71)
$2N3451: length 28.7
  Top Layer w0.254: v1(64.57,38.82) 62.29,41.11 B13.2 ; v1(76.26,27.33) 80.57,23.01 81.08,23.01 81.54,22.56 PCA-B1.20
  Bottom Layer w0.254: v1(76.26,27.33) 64.77,38.82 v1(64.57,38.82)
$2N3452: length 38.6
  Top Layer w0.254: B12.2 65.33,41.11 65.33,35.27 67.87,32.73 69.14,32.73 69.65,33.24 69.65,34.25 70.16,34.76 71.18,34.76 75.24,30.7 75.24,23.33 78.86,19.71 79.56,19.71 80.89,21.04 PCA-B1.19
$2N3453: length 28.6
  Top Layer w0.254: B11.2 72.35,44.87 72.35,37.51 76.92,32.94 76.92,30.4 75.65,29.13 75.65,27.09 79.71,23.03 79.97,23.03 80.23,22.76 PCA-B1.18
$2N3454: length 40.2
  Top Layer w0.254: v1(79.35,20.53) 79.58,20.76 PCA-B1.17 ; B10.2 78.8,54.32 78.8,48.22 79.58,47.43 v1(79.58,29.65)
  Bottom Layer w0.254: v1(79.58,29.65) 79.58,20.76 v1(79.35,20.53)
$2N3455: length 32
  Top Layer w0.254: v1(78.68,23.19) 78.94,22.94 PCA-B1.16 ; v1(78.94,40.21) 78.29,40.86 78.29,50.76 B9.2
  Bottom Layer w0.254: v1(78.68,23.19) 78.94,23.44 v1(78.94,40.21)
$2N3456: length 28.3
  Top Layer w0.254: v1(78.03,29.68) 78.03,38.57 74.48,42.13 74.48,45.43 B8.2 ; PCA-B1.15 78.03,22.05 v1(78.03,23.84)
  Bottom Layer w0.254: v1(78.03,23.84) 78.29,24.09 78.29,29.43 v1(78.03,29.68)
$2N3457: length 47.1
  Top Layer w0.254: PCA-C1.22 15.72,80.31 16.99,80.31 17.75,81.07 17.75,81.83 17.5,82.09 v1(17.5,82.34) ; v1(12.42,61.26) 2.51,51.35 C15.2
  Bottom Layer w0.254: v1(17.5,82.34) 15.97,83.87 13.94,83.87 12.16,82.09 12.16,67.86 11.66,67.36 11.66,62.02 v1(12.42,61.26)
$2N3458: length 38.1
  Top Layer w0.254: C14.2 14.96,55.42 v1(14.96,63.8) ; PCA-C1.21 15.72,79.67 16.48,79.67 17.24,78.9 v1(17.24,78.02)
  Bottom Layer w0.254: v1(14.96,63.8) 15.72,64.56 15.72,76.5 v1(17.24,78.02)
$2N3459: length 36.2
  Top Layer w0.254: PCA-C1.20 14.69,79.03 v1(14.45,78.79) ; v1(14.96,64.82) 15.72,64.05 15.72,50.59 C13.2
  Bottom Layer w0.254: v1(14.96,64.82) 14.96,78.28 v1(14.45,78.79)
$2N3460: length 33.7
  Top Layer w0.254: v1(14.34,77.77) 14.95,78.38 PCA-C1.19 ; C12.2 16.23,51.1 v1(16.74,51.61)
  Bottom Layer w0.254: v1(16.74,51.61) 17.5,52.37 17.5,57.45 14.34,60.61 v1(14.34,77.77)
$2N3461: length 29.5
  Top Layer w0.254: C11.2 16.23,54.91 16.23,63.04 v1(16.48,63.29) ; PCA-C1.18 15.76,77.77 16.43,77.77 16.99,77.21 v1(16.99,76.75)
  Bottom Layer w0.254: v1(16.48,63.29) 16.48,76.25 v1(16.99,76.75)
$2N3462: length 45.3
  Top Layer w0.254: PCA-C1.17 14.19,77.08 13.6,77.66 13.6,79.03 v1(13.86,79.29) ; v1(16.91,57.11) 20.97,53.05 20.97,45.94 C10.2
  Bottom Layer w0.254: v1(16.91,57.11) 13.6,60.41 13.6,79.03 v1(13.86,79.29)
$2N3463: length 44.4
  Top Layer w0.254: v1(16.91,62.45) 16.91,58.13 21.48,53.56 21.48,49.75 C9.2 ; v1(14.37,79.97) 13.6,79.97 13.1,79.46 13.1,77.52 14.11,76.5 15.64,76.5 PCA-C1.16
  Bottom Layer w0.254: v1(16.91,62.45) 17.92,63.46 17.92,78.19 16.14,79.97 v1(14.37,79.97)
$2N3464: length 28.1
  Top Layer w0.254: PCA-C1.15 16.59,74.89 v1(18.68,74.89) ; C8.2 17.92,58.38 v1(17.92,59.65)
  Bottom Layer w0.254: v1(17.92,59.65) 18.68,60.41 v1(18.68,74.89)
$2N3465: length 19.8
  Top Layer w0.254: v1(29.44,36.11) 28.67,35.35 28.67,31.8 29.48,30.99 PCA-D1.22 ; D15.2 v1(28.93,37.64)
  Bottom Layer w0.254: v1(28.93,37.64) 28.93,36.62 v1(29.44,36.11)
$2N3466: length 11.6
  Top Layer w0.254: D13.2 30.79,28.32 PCA-D1.20
$2N3467: length 14.8
  Top Layer w0.254: D14.2 29.18,33.83 29.18,32.05 30.14,31.1 PCA-D1.21
$2N3468: length 10
  Top Layer w0.254: D12.2 31.44,21.86 PCA-D1.19
$2N3469: length 16.3
  Top Layer w0.254: v1(34.77,22.4) 38.33,22.4 D11.2 ; v1(31.07,19.5) 31.58,19.5 32.08,20 PCA-D1.18
  Bottom Layer w0.254: v1(34.77,22.4) 33.97,22.4 v1(31.07,19.5)
$2N3470: length 18.1
  Top Layer w0.254: D10.2 43.58,27.39 41.8,27.39 37.48,23.08 33.92,23.08 32.73,21.89 32.73,20.9
$2N3471: length 44.4
  Top Layer w0.254: v1(55.43,26.38) 50.6,26.38 v1(49.59,25.36) ; D9.2 70.67,33.49 68.89,31.71 v1(67.11,31.71) ; PCA-D1.16 33.39,19.94 33.69,19.63 35.47,19.63 v1(36.74,20.9)
  Bottom Layer w0.254: v1(36.74,20.9) 41.2,25.36 v1(49.59,25.36) ; v1(55.43,26.38) 60.76,31.71 v1(67.11,31.71)
$2N3472: length 38.7
  Top Layer w0.254: v1(55.68,21.55) 57.71,23.58 v1(58.22,23.58) ; D8.2 67.11,30.19 v1(65.84,28.92) ; v1(34.71,21.15) 34.29,21.15 PCA-D1.15
  Bottom Layer w0.254: v1(58.22,23.58) 63.56,28.92 v1(65.84,28.92) ; v1(34.71,21.15) 36.49,19.38 48.43,19.38 50.6,21.55 v1(55.68,21.55)

## Copper pours and planes (outline as drawn; the poured copper is in the pictures)
GND on Top Layer: 0.23,99.78 99.79,99.78 99.79,0.22 0.23,0.22
GND on Bottom Layer: 0.48,99.4 99.39,99.4 99.39,0.5 0.48,0.5

## Text on the board
Bottom Silkscreen Layer: D+ | D- | +5v | GND | GPIO1 | SWCLK | SWDIO | +3V3 | RUN | BOOTSEL | Firefly Garden Display V1 / @2026 by Jeffrey Beman
